# Altium schematic sheet Power.SchDoc
size A; SheetNumber: 1; SheetTotal: 10
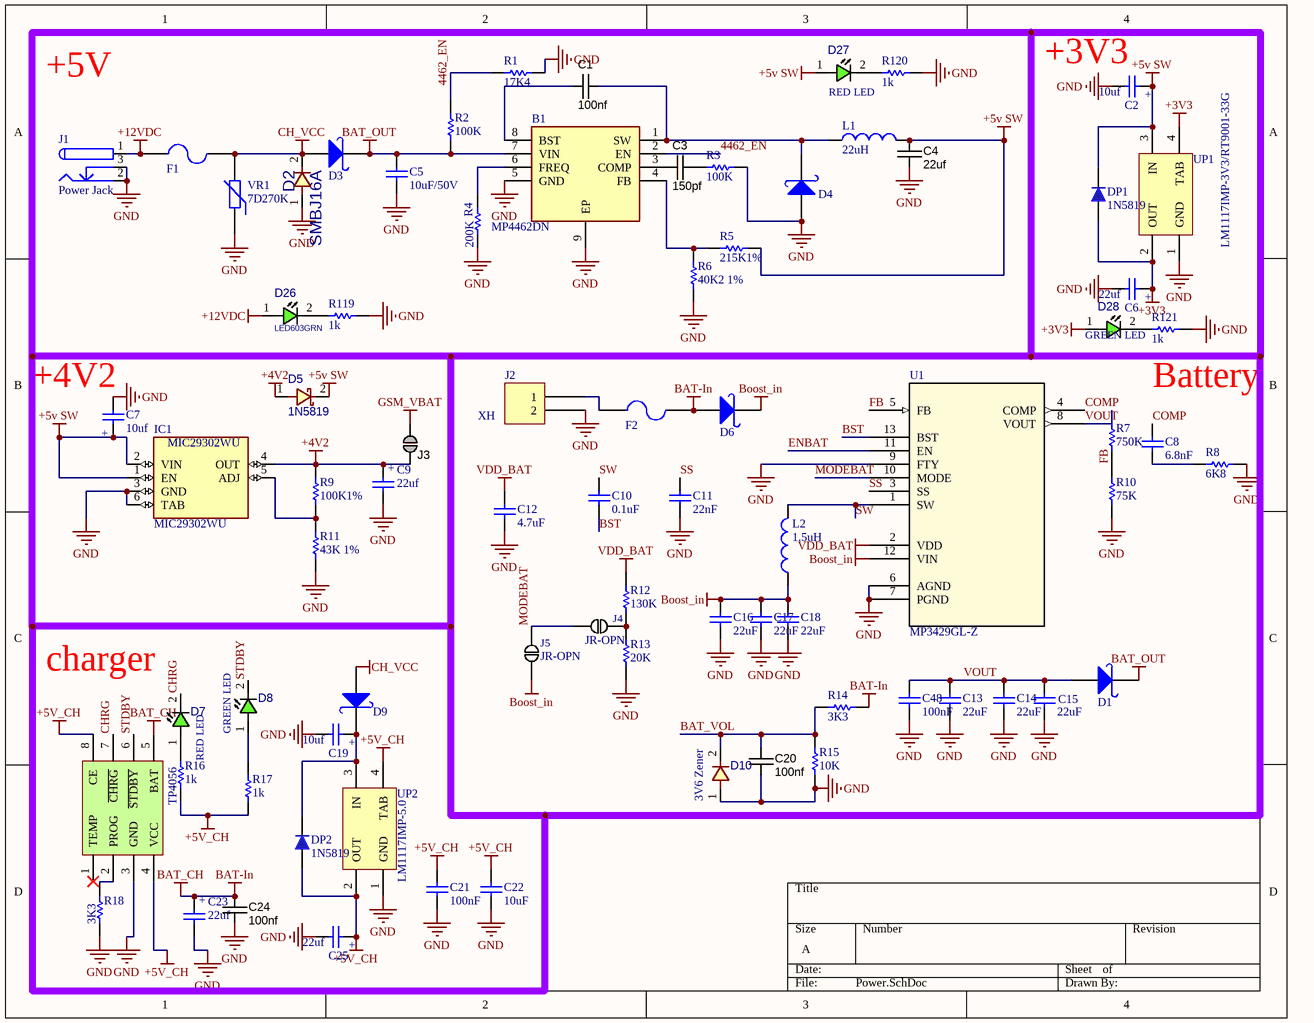
[diagram p0: Power.SchDoc]

## Parts
B1  MP4462DN  [SOIC127P600X170-9N]
C1  100nf  [CAPC1608X90N]
C2  10uf  [MY_CAP_SMD-A]
C3  150pf  [CAPC1608X90N]
C4  22uf  [CAPC1608X90N]
C5  10uF/50V
C6  22uf  [MY_CAP_SMD-A]
C7  10uf  [MY_CAP_SMD-A]
C8  6.8nF  [CAPC3413X12N]
C9  22uf  [MY_CAP_SMD-A]
C10  0.1uF  [CAPC3413X12N]
C11  22nF  [CAPC3413X12N]
C12  4.7uF  [CAPC3413X12N]
C13  22uF  [CAPC3413X12N]
C14  22uF  [CAPC3413X12N]
C15  22uF  [CAPC3413X12N]
C16  22uF  [CAPC3413X12N]
C17  22uF  [CAPC3413X12N]
C18  22uF  [CAPC3413X12N]
C19  10uf  [MY_CAP_SMD-A]
C20  100nf  [CAPC1608X90N]
C21  100nF  [CAPC3413X12N]
C22  10uF  [CAPC3413X12N]
C23  22uf  [MY_CAP_SMD-A]
C24  100nf  [CAPC1608X90N]
C25  22uf  [MY_CAP_SMD-A]
C48  100nF  [CAPC3413X12N]
D1  1n5822  [DO-214AB(SMC)]  (value not drawn)
D2  value SMBJ16A  [DO214AA SMB]  (hidden comment: SMBJ16A-TR)
D3  1n5822  [DO-214AB(SMC)]  (value not drawn)
D4  1n5822  [DO-214AB(SMC)]  (value not drawn)
D5  1N5819  [D_SOD123W]
D6  1n5822  [DO-214AB(SMC)]  (value not drawn)
D7  RED LED  [LED0603GRN]
D8  GREEN LED  [LED0603GRN]
D9  1n5822  [DO-214AB(SMC)]  (value not drawn)
D10  value 3V6 Zener  [D_SOD80]  (hidden comment: 5Z1)
D26  LED603GRN  [LED0603GRN]
D27  RED LED  [LED0603GRN]
D28  GREEN LED  [LED0603GRN]
DP1  1N5819  [430X270D]
DP2  1N5819  [430X270D]
F1  FUSE Socket  [Crystal SMD]  (value not drawn)
F2  FUSE Socket  (value not drawn)
IC1  MIC29302WU  [TO263-5]
J1  Power Jack  [Power Jack]
J2  XH  [JST XH B2B-XH-A]
J3  Jumper  [JUMP1]  (value not drawn)  (no BOM)
J4  JR-OPN
J5  JR-OPN
L1  22uH  [INDUCTOR_SMD_3A]
L2  1.5uH  [INDUCTOR_SMD_3A]
R1  17K4  [Resistor_SMD_0603 (1608)]
R2  100K  [Resistor_SMD_0603 (1608)]
R3  100K  [Resistor_SMD_0603 (1608)]
R4  200K  [Resistor_SMD_0603 (1608)]
R5  215K1%  [Resistor_SMD_0603 (1608)]
R6  40K2 1%  [Resistor_SMD_0603 (1608)]
R7  750K  [Resistor_SMD_0603 (1608)]
R8  6K8  [Resistor_SMD_0603 (1608)]
R9  100K1%  [Resistor_SMD_0603 (1608)]
R10  75K  [Resistor_SMD_0603 (1608)]
R11  43K 1%  [Resistor_SMD_0603 (1608)]
R12  130K  [Resistor_SMD_0603 (1608)]
R13  20K  [Resistor_SMD_0603 (1608)]
R14  3K3  [Resistor_SMD_0603 (1608)]
R15  10K  [Resistor_SMD_0603 (1608)]
R16  1k  [Resistor_SMD_0603 (1608)]
R17  1k  [Resistor_SMD_0603 (1608)]
R18  3K3  [Resistor_SMD_0603 (1608)]
R119  1k  [Resistor_SMD_0603 (1608)]
R120  1k  [Resistor_SMD_0603 (1608)]
R121  1k  [Resistor_SMD_0603 (1608)]
TP4056  TP4056  [TP4056]  (value not drawn)
U1  MP3429GL-Z  [QFN-3x4_MP3429_MNP]
UP1  LM1117IMP-3V3/RT9001-33G  [SOT223_M]
UP2  LM1117IMP-5.0  [SOT223_M]
VR1  7D270K  [05D XXX]

## Nets
+3V3: C6.+ D28.1(ANODE) DP1.1 UP1.2(OUT) UP1.4(TAB)
+4V2: C9.+ D5.1 IC1.4(OUT) J3.2 R9.2
+5v SW: C2.+ C4.2 C7.+ D5.2 D27.1(ANODE) DP1.2 IC1.1(EN) IC1.2(VIN) L1.2 R5.1 UP1.3(IN)
+5V_CH: C21.2 C22.2 C25.+ DP2.1 R16.1 R17.1 TP4056.4(VCC) TP4056.8(CE) UP2.2(OUT) UP2.4(TAB)
+12VDC: D26.1(ANODE) F1.1 J1.1
BAT-In: C23.+ C24.1 D6.1(A) F2.2 R14.2 TP4056.5(BAT)  [also labelled BAT_CH]
BAT_OUT: B1.7(VIN) C5.2 D1.2(K) D3.2(K) R2.1
Boost_in: C16.2 C17.2 C18.2 D6.2(K) J5.2 L2.1 U1.12(VIN)
CH_VCC: D2.2 D3.1(A) D9.1(A) F1.2 VR1.2
GND: B1.5(GND) B1.9(EP) C2.- C4.1 C5.1 C6.- C7.- C9.- C11.1 C12.1 C13.1 C14.1 C15.1 C16.1 C17.1 C18.1 C19.- C20.2 C21.1 C22.1 C23.- C24.2 C25.- C48.1 D2.1 D4.1(A) D10.1 IC1.3(GND) IC1.6(TAB) J1.2 J1.3 J2.2 R1.2 R3.1 R4.2 R6.1 R8.1 R10.1 R11.1 R13.1 R15.1 R18.1 R119.2 R120.2 R121.2 TP4056.3(GND) U1.6(AGND) U1.7(PGND) U1.9(FTY) UP1.1(GND) UP2.1(GND) VR1.1
GSM_VBAT: J3.1
VDD_BAT: C12.2 R12.2 U1.2(VDD)
4462_EN: B1.2(EN) R1.1 R2.2
BAT_VOL: C20.1 D10.2 R14.1 R15.2
BST: C10.1 U1.13(BST)
CHRG: D7.2(CATHODE) TP4056.7(~{CHRG})
COMP: C8.2 U1.4(COMP)
ENBAT: U1.11(EN)
FB: R7.1 R10.2 U1.5(FB)
MODEBAT: J4.2 J5.1 U1.10(MODE)
SS: C11.2 U1.3(SS)
STDBY: D8.2(CATHODE) TP4056.6(~{STDBY})
SW: C10.2 L2.2 U1.1(SW)
VOUT: C13.2 C14.2 C15.2 C48.2 D1.1(A) R7.2 U1.8(VOUT)
NetB1_1: B1.1(SW) C1.2 D4.2(K) L1.1
NetB1_3: B1.3(COMP) C3.1
NetB1_4: B1.4(FB) R5.2 R6.2
NetB1_6: B1.6(FREQ) R4.1
NetB1_8: B1.8(BST) C1.1
NetC3_2: C3.2 R3.2
NetC8_1: C8.1 R8.2
NetC19_+: C19.+ D9.2(K) DP2.2 UP2.3(IN)
NetD7_1: D7.1(ANODE) R16.2
NetD8_1: D8.1(ANODE) R17.2
NetD26_2: D26.2(CATHODE) R119.1
NetD27_2: D27.2(CATHODE) R120.1
NetD28_2: D28.2(CATHODE) R121.1
NetF2_1: F2.1 J2.1
NetIC1_5: IC1.5(ADJ) R9.1 R11.2
NetJ4_1: J4.1 R12.1 R13.2
NetR18_2: R18.2 TP4056.2(PROG)

Not connected (* = marked no-connect by the designer): TP4056 1(TEMP)*

## Notes on the sheet
- +5V
- (near C2) +3V3
- (near C7) +4V2
- Battery
- (near D7) charger

## Library data of the parts
B1 = MP4462DN-Z-LF: Power Supply; Manufacturer_Name: Monolithic Power Systems (MPS); Geometry.Height: 1.7mm; Manufacturer_Part_Number: MP4462DN-Z-LF; Mouser Part Number: *; Mouser Price/Stock: *; Arrow Part Number: *; Arrow Price/Stock: *; Datasheet Link: https://datasheet.octopart.com/MP4462DN-LF-Z-Monolithic-Power-Systems-datasheet-26450847.pdf
C1 C3 = CAPC_100n_0603_X7R_50V_10%: Capacitor C SMD 0603; Manufacturer 1: AVX Corporation; Manufacturer Part Number 1: 06035C104KAT2A; Tolerance: ±10%; Ratings: 50V; X7R; Material: ceramic; SCDType: spec; Value: 100n; Manufacturer 2: TDK Corporation; Manufacturer Part Number 2: C1608X7R1H104K; Package / Case: 0603 (1608 Metric); Supplier 1: Digi-Key; Supplier Part Number 1: 478-5052-1-ND; ComponentLink1URL: http://www.avx.com/docs/Catalogs/cx7r.pdf; ComponentLink1Description: http://www.avx.com/docs/Catalogs/cx7r.pdf; Supplier 2: Digi-Key; Supplier Part Number 2: 445-1314-1-ND; ComponentLink2URL: http://product.tdk.com/capacitor/mlcc/en/documents/mlcc_commercial_general_en.pdf; ComponentLink2Description: http://product.tdk.com/capacitor/mlcc/en/documents/mlcc_commercial_general_en.pdf
C2 C6 C7 C9 C23 = CAP_TANTAL_A: Capacitor Tantalum SMD; Value: 3300u
C4 = CAPC_100n_0603_X7R_50V_10%: Capacitor C SMD 1206; Manufacturer 1: AVX Corporation; Manufacturer Part Number 1: 06035C104KAT2A; Tolerance: ±10%; Ratings: 50V; X7R; Material: ceramic; SCDType: spec; Value: 100n; Manufacturer 2: TDK Corporation; Manufacturer Part Number 2: C1608X7R1H104K; Package / Case: 0603 (1608 Metric); Supplier 1: Digi-Key; Supplier Part Number 1: 478-5052-1-ND; ComponentLink1URL: http://www.avx.com/docs/Catalogs/cx7r.pdf; ComponentLink1Description: http://www.avx.com/docs/Catalogs/cx7r.pdf; Supplier 2: Digi-Key; Supplier Part Number 2: 445-1314-1-ND; ComponentLink2URL: http://product.tdk.com/capacitor/mlcc/en/documents/mlcc_commercial_general_en.pdf; ComponentLink2Description: http://product.tdk.com/capacitor/mlcc/en/documents/mlcc_commercial_general_en.pdf
C5 = CAP SMD 0805: Capacitor C SMD 1206
C8 = CAP SMD 0805: Capacitor C SMD 0603; Designer: Abbas Basereh; Desc.: CAP SMD 0805; Data: 16-12-2016
C10-C15 C18 C21 C22 C48 = CAP SMD 0805: CAP 0805; Designer: Abbas Basereh; Desc.: CAP SMD 0805; Data: 16-12-2016
C16 C17 = CAP SMD 0805: Capacitor C SMD 0805; Designer: Abbas Basereh; Desc.: CAP SMD 0805; Data: 16-12-2016
C19 C25 = CAP_TANTAL_A: 3.2X1.6MM; Value: 3300u
C20 C24 = CAPC_100n_0603_X7R_50V_10%: Capacitor SMD Cer 100nF 10% 50V X7R 0603; Manufacturer 1: AVX Corporation; Manufacturer Part Number 1: 06035C104KAT2A; Ratings: 50V; X7R; Material: ceramic; SCDType: spec; Value: 100n; Manufacturer 2: TDK Corporation; Manufacturer Part Number 2: C1608X7R1H104K; Package / Case: 0603 (1608 Metric); Tolerance: ±10%; Supplier 1: Digi-Key; Supplier Part Number 1: 478-5052-1-ND; ComponentLink1URL: http://www.avx.com/docs/Catalogs/cx7r.pdf; ComponentLink1Description: http://www.avx.com/docs/Catalogs/cx7r.pdf; Supplier 2: Digi-Key; Supplier Part Number 2: 445-1314-1-ND; ComponentLink2URL: http://product.tdk.com/capacitor/mlcc/en/documents/mlcc_commercial_general_en.pdf; ComponentLink2Description: http://product.tdk.com/capacitor/mlcc/en/documents/mlcc_commercial_general_en.pdf
D1 D3 D4 D6 D9 = 1n5822 SMD: Schottky Rectifiers; Part. No: SS34; Manufacturer: ON Semiconductor/Fairchild; Designer: Abbas Basereh; Link: https://www.aliexpress.com/item/Free-shipping-100pcs-1n5822-sma-smd-do-214ac-Schottky-diode-ss34/32337482329.html?spm=2114.01010208.3.1.zLZDsP&ws_ab_test=searchweb0_0,searchweb201602_4_10065_10068_10084_10083_10080_10082_10081_10060_10061_10062_10056_10055_10054_10059_10099_10078_10079_427_10073_10103_10102_10096_10052_10050_10051,searchweb201603_4&btsid=6e50dc92-ac69-45bc-a19e-209af19ce602; Link: http://www.tme.eu/en/details/ss34/smd-schottky-diodes/vishay/ss34-e357t/; Link: http://www.digikey.com/product-detail/en/on-semiconductor-fairchild/SS34/SS34FSCT-ND/2094459; Data: 16-12-2016
D2 = SMBJ12A-TR: TVS Surface Mount Transient Voltage Suppressors Diode
D5 = DIODE_SMD_SCHOTTKY_1N5819: DIODE, GENERAL PURPOSE, 1000V/1A; MANF: DIODES; MANF_P#: 1N5819HW-7-F; DESC: DESCRIPTION; PARAM2: 1A; PARAM: 40V; ASSEMBLY: ASSEMBLY; PRICE: PRICE; VALUE: 1N5819
D7 D8 D27 D28 = LED_SMD_0603_GRN: LED, SMD, 0603, GREEN; PARAM: 20mA; MANF: Kingbright; DESC: DESCRIPTION; MANF_P#: APT1608SGC; PARAM2: 2.2V; VALUE: LED603GRN; ASSEMBLY: ASSEMBLY; PRICE: 1: 0.14$, 100: 6.8$
D10 = 1N4148 SMD: DIODE, FAST SWTICHING, 0.3A, 0.5W
D26 = LED_SMD_0603_GRN: LED, SMD, 0603, GREEN; PARAM: 20mA; MANF: Kingbright; DESC: DESCRIPTION; MANF_P#: APT1608SGC; PARAM2: 2.2V; ASSEMBLY: ASSEMBLY; PRICE: 1: 0.14$, 100: 6.8$; VALUE: LED603GRN
DP1 = 1N5819: DIODE, GENERAL PURPOSE, 1000V/1A; Designer: Abbas Basereh; Data: 16-12-2016; Link: *; Part. No: *
DP2 = 1N5819: Schottkey Rectifiers; Designer: Abbas Basereh; Data: 16-12-2016; Link: *; Part. No: *
F1 F2 = Fuse SMD1206: SMD Fuses 1808; Designer: Abbas Basereh; Desc.: SMD Fuses 1206; Data: 16-12-2016
IC1 = MIC29302WU: Linear Voltage Regulator IC 1 Output 3A TO-263-5; MF: {'manufacturer': u'Microchip Technology'}; Package: None; Price: None; Value: *; MP: MIC29302WU; Availability: Unavailable
J2 = B2B-XH-A(LF)(SN): CONN HEADER VERT 2POS 2.5MM XH; Manufacturer: JST Sales America Inc.; Contact Length - Post: 0.134" (3.40mm); Current Rating (Amps): 3A; Material Flammability Rating: UL94 V-0; Number of Positions: 2; Number of Positions Loaded: All; Pitch - Mating: 0.098" (2.50mm); Shrouding: Shrouded - 4 Wall; Style: Board to Cable/Wire; Voltage Rating: 250V; Part Number: B2B-XH-A(LF)(SN); ComponentLink1Description: Datasheet; ComponentLink1URL: http://www.jst-mfg.com/product/pdf/eng/eXH.pdf; ComponentLink2Description: DigiKey Link; ComponentLink2URL: http://digikey.com/product-detail/en/jst-sales-america-inc/B2B-XH-A-LF-SN/455-2247-ND/1651045; Connector Type: Header; Contact Finish - Mating: Tin; Contact Finish - Post: Tin; Contact Material: Brass; Contact Shape: Square; Contact Type: Male Pin; Fastening Type: Detent Lock; Insulation Color: Natural; Insulation Height: 0.276" (7.00mm); Insulation Material: Polyamide (PA66), Nylon 6/6; LastUpdated: 1/12/2020 11:46:08 PM; Lifecycle Status: Active; Minimum Order: 1; Mounting Type: Through Hole; Number of Rows: 1; Operating Temperature: -25°C ~ 85°C; Packaging: Bulk; PartId: 67; Part Status: Active; Price: 0.15; Series: XH; Supplier 1: DigiKey; Supplier Part Number 1: 455-2247-ND; Termination: Press-Fit, Solder
J3 = JUMP1: SMD jumper
J4 J5 = BYPASS: SOLDERDOT BYPASS; Manufacturer Part Number 1: Board Feature; Reel: Open; Supplier 1: Solder-it-yourself; Manufacturer 1: Board feature
L1 L2 = INDUCTOR_SMD_3A
R1 R5 = Resistor: Resistor SMD 0805; Email: razi.vesali@gmail.com; Value: 10k; Published: 17-Jun-2016; LatestRevisionNote: Re-released for puplic; Publisher: Seyed Razi Vesali
R2-R4 R6 = Resistor: Resistor SMD 0603; Email: razi.vesali@gmail.com; Value: 10k; Published: 17-Jun-2016; LatestRevisionNote: Re-released for puplic; Publisher: Seyed Razi Vesali
R7-R11 R13 R14 R17 R18 R120 R121 = Resistor: Resistor 0603; Email: razi.vesali@gmail.com; Value: 10k; Published: 17-Jun-2016; LatestRevisionNote: Re-released for puplic; Publisher: Seyed Razi Vesali
R12 R16 = Resistor: Resistor0603; Email: razi.vesali@gmail.com; Value: 10k; Published: 17-Jun-2016; LatestRevisionNote: Re-released for puplic; Publisher: Seyed Razi Vesali
R15 = Resistor: Resistor 0603; Email: razi.vesali@gmail.com; Published: 17-Jun-2016; LatestRevisionNote: Re-released for puplic; Publisher: Seyed Razi Vesali; Value: 10k
R119 = Resistor: Email: razi.vesali@gmail.com; Value: 10k; Published: 17-Jun-2016; LatestRevisionNote: Re-released for puplic; Publisher: Seyed Razi Vesali
U1 = MP3429GL-Z: No Description Available; Mfr_Name: Monolithic Power Systems; Copyright: Copyright (C) 2022 Ultra Librarian. All rights reserved.; Manufacturer_Part_Number: MP3429GL-Z; RefDes: RefDes; Type: DEV
UP1 UP2 = AMS1117-x.x: x.x Volt, 800mA Low-Dropout Linear Regulator, 4-pin SOT-223; Designer: Ali Hafizi; Data: 16-12-2016
VR1 = VARISTOR (VDR): VARISTORS; Manufacturer: china-canada-philipina; Designer: Abbas Basereh; VALUE: xxDxxx; Models: MOV-VDR-COV; Data: 2017-1-5; Link: digikey.com; PUBLISHER: ABBAS BASEREH